# Altium project probe_v2.PrjPcb
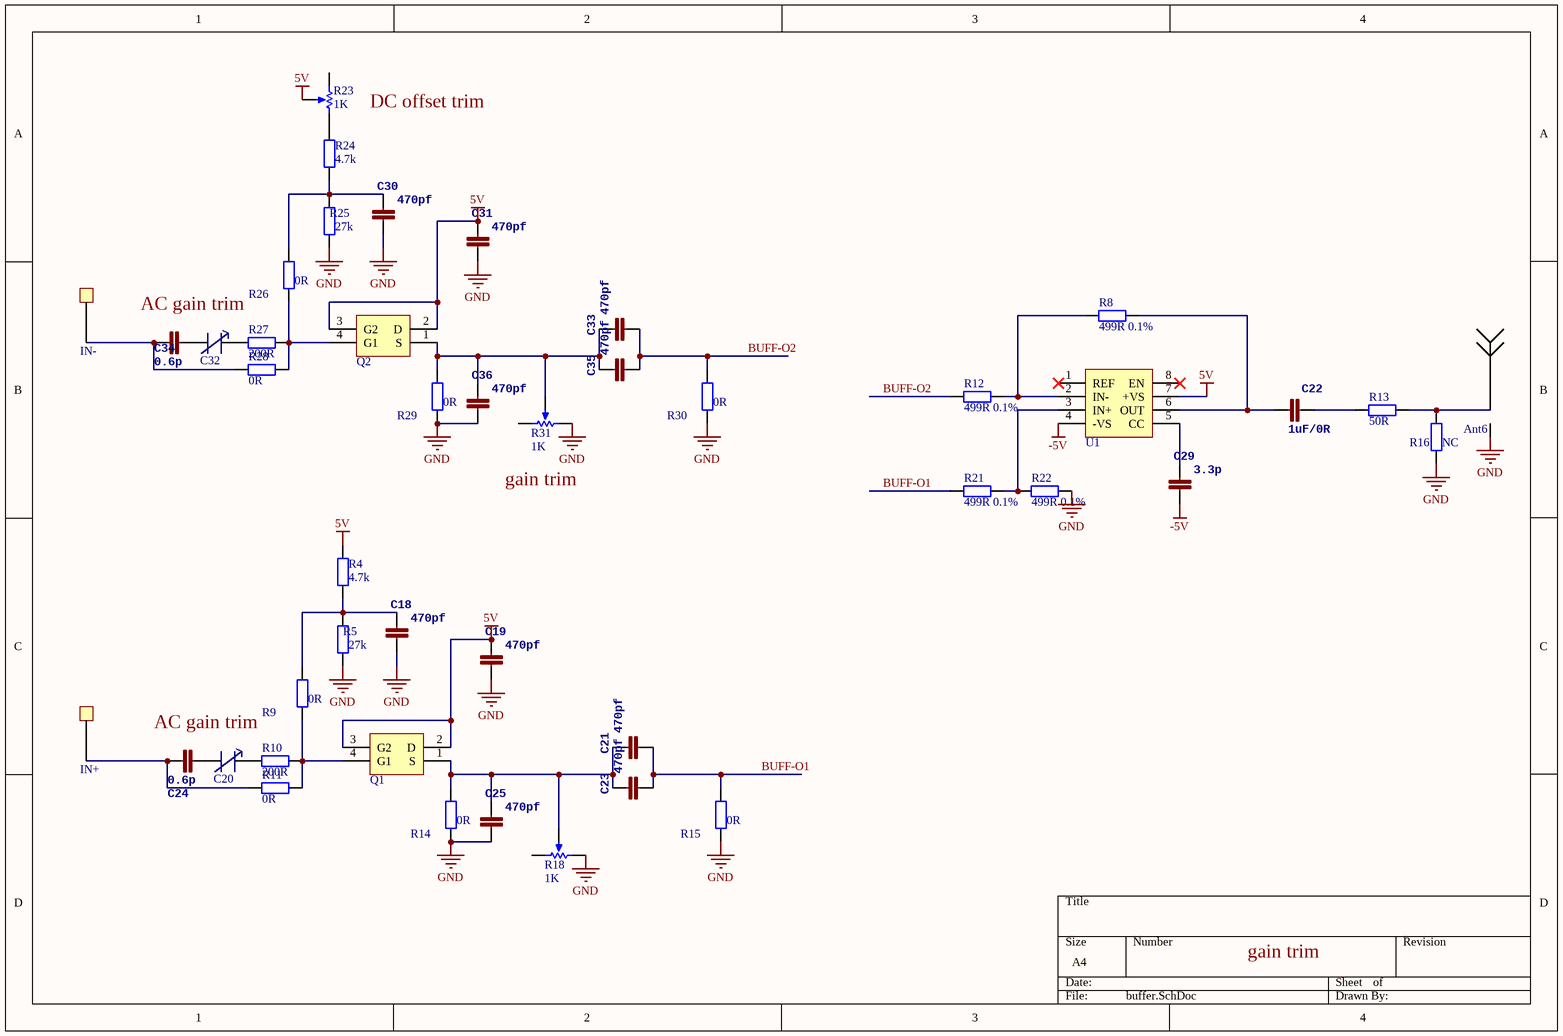
[diagram p0: buffer.SchDoc]
2 sheets, 78 parts. Net scope: global (net labels, ports and power ports of the same name join across sheets).
Board file: probe_v2.PcbDoc
Sheets:
  buffer.SchDoc
  power.SchDoc

## Sheet buffer.SchDoc
size A4

### Parts
Ant6  Antenna  [SMA-HOLE]  (value not drawn)
C18  470pf  [0402]
C19  470pf  [0805]
C20  TZY2R200AC01R00  [TRIM_C]  (value not drawn)
C21  470pf  [0402]
C22  1uF/0R  [0402]
C23  470pf  [0402]
C24  0.6p  [0402]
C25  470pf  [0402]
C29  3.3p  [0402]
C30  470pf  [0402]
C31  470pf  [0805]
C32  TZY2R200AC01R00  [TRIM_C]  (value not drawn)
C33  470pf  [0402]
C34  0.6p  [0402]
C35  470pf  [0402]
C36  470pf  [0402]
IN+  TestPad  [TestPad]  (value not drawn)
IN-  TestPad  [TestPad]  (value not drawn)
Q1  BF998  [SOT143]  (value not drawn)
Q2  BF998  [SOT143]  (value not drawn)
R4  4.7k  [0402]
R5  27k  [0402]
R8  499R 0.1%  [0402]
R9  0R  [0402]
R10  200R  [0402]
R11  0R  [0402]
R12  499R 0.1%  [0402]
R13  50R  [0402]
R14  0R  [0402]
R15  0R  [0402]
R16  NC  [0402]
R18  value 1K  [POT1]  (hidden comment: RPot)
R21  499R 0.1%  [0402]
R22  499R 0.1%  [0402]
R23  value 1K  [POT1]  (hidden comment: RPot)
R24  4.7k  [0402]
R25  27k  [0402]
R26  0R  [0402]
R27  200R  [0402]
R28  0R  [0402]
R29  0R  [0402]
R30  0R  [0402]
R31  value 1K  [POT1]  (hidden comment: RPot)
U1  AD8021  [SO8]  (value not drawn)

### Nets
5V: C19.2 C31.2 Q1.2(D) Q1.3(G2) Q2.2(D) Q2.3(G2) R4.2 R23.3(TAP) U1.7(+VS)
-5V: C29.1 U1.4(-VS)
GND: Ant6.GND(G) C18.1 C19.1 C25.1 C30.1 C31.1 C36.1 R5.2 R14.2 R15.2 R16.2 R18.1(TOP) R22.1 R25.2 R29.2 R30.2 R31.1(TOP)
BUFF-O1: C21.1 C23.1 R15.1 R21.1
BUFF-O2: C33.1 C35.1 R12.1 R30.1
NetAnt6_1: Ant6.1 R13.2 R16.1
NetC18_2: C18.2 R4.1 R5.1 R9.1
NetC20_1: C20.1 C24.1
NetC20_2: C20.2 R10.1
NetC21_2: C21.2 C23.2 C25.2 Q1.1(S) R14.1 R18.3(TAP)
NetC22_1: C22.1 R13.1
NetC22_2: C22.2 R8.2 U1.6(OUT)
NetC24_2: C24.2 IN+.1 R11.1
NetC29_2: C29.2 U1.5(CC)
NetC30_2: C30.2 R24.1 R25.1 R26.1
NetC32_1: C32.1 C34.1
NetC32_2: C32.2 R27.1
NetC33_2: C33.2 C35.2 C36.2 Q2.1(S) R29.1 R31.3(TAP)
NetC34_2: C34.2 IN-.1 R28.1
NetQ1_4: Q1.4(G1) R9.2 R10.2 R11.2
NetQ2_4: Q2.4(G1) R26.2 R27.2 R28.2
NetR8_1: R8.1 R12.2 U1.2(IN-)
NetR21_2: R21.2 R22.2 U1.3(IN+)
NetR23_2: R23.2(BOT) R24.2

Not connected (* = marked no-connect by the designer): R18 2(BOT); R23 1(TOP); R31 2(BOT); U1 1(REF)* 8(EN)*

### Notes on the sheet
- DC offset trim
- AC gain trim
- gain trim

### Library data of the parts
C18 C19 C21-C25 C29-C31 C33-C36 = CAP0402-CAP: <b>Capacitor</b> / Standard 0603 ceramic capacitor, and 0.1" leaded capacitor.; PARTNO: CC0402ZRY5V7BB104
C20 C32 = TRIM_C
R4 R5 R8-R16 R21 R22 R24-R30 = Res2: Resistor; Published: 8-Jun-2000; LatestRevisionDate: 17-Jul-2002; LatestRevisionNote: Re-released for DXP Platform.; PackageReference: AXIAL-0.4; Publisher: Altium Limited; PackageDescription: Axial Device, Thru-Hole; 2 Leads; 0.4 in Pin Spacing
R18 R23 R31 = RPot: Potentiometer; Sim Note: Enter the Resistance value and the set point into parameter fields.; Set Position: 0.5; Published: 8-Jun-2000; LatestRevisionDate: 17-Jul-2002; LatestRevisionNote: Re-released for DXP Platform.; PackageReference: VR5; Publisher: Altium Limited; PackageDescription: Variable Resistor, Thru-Hole; 3 Leads

## Sheet power.SchDoc
size A4
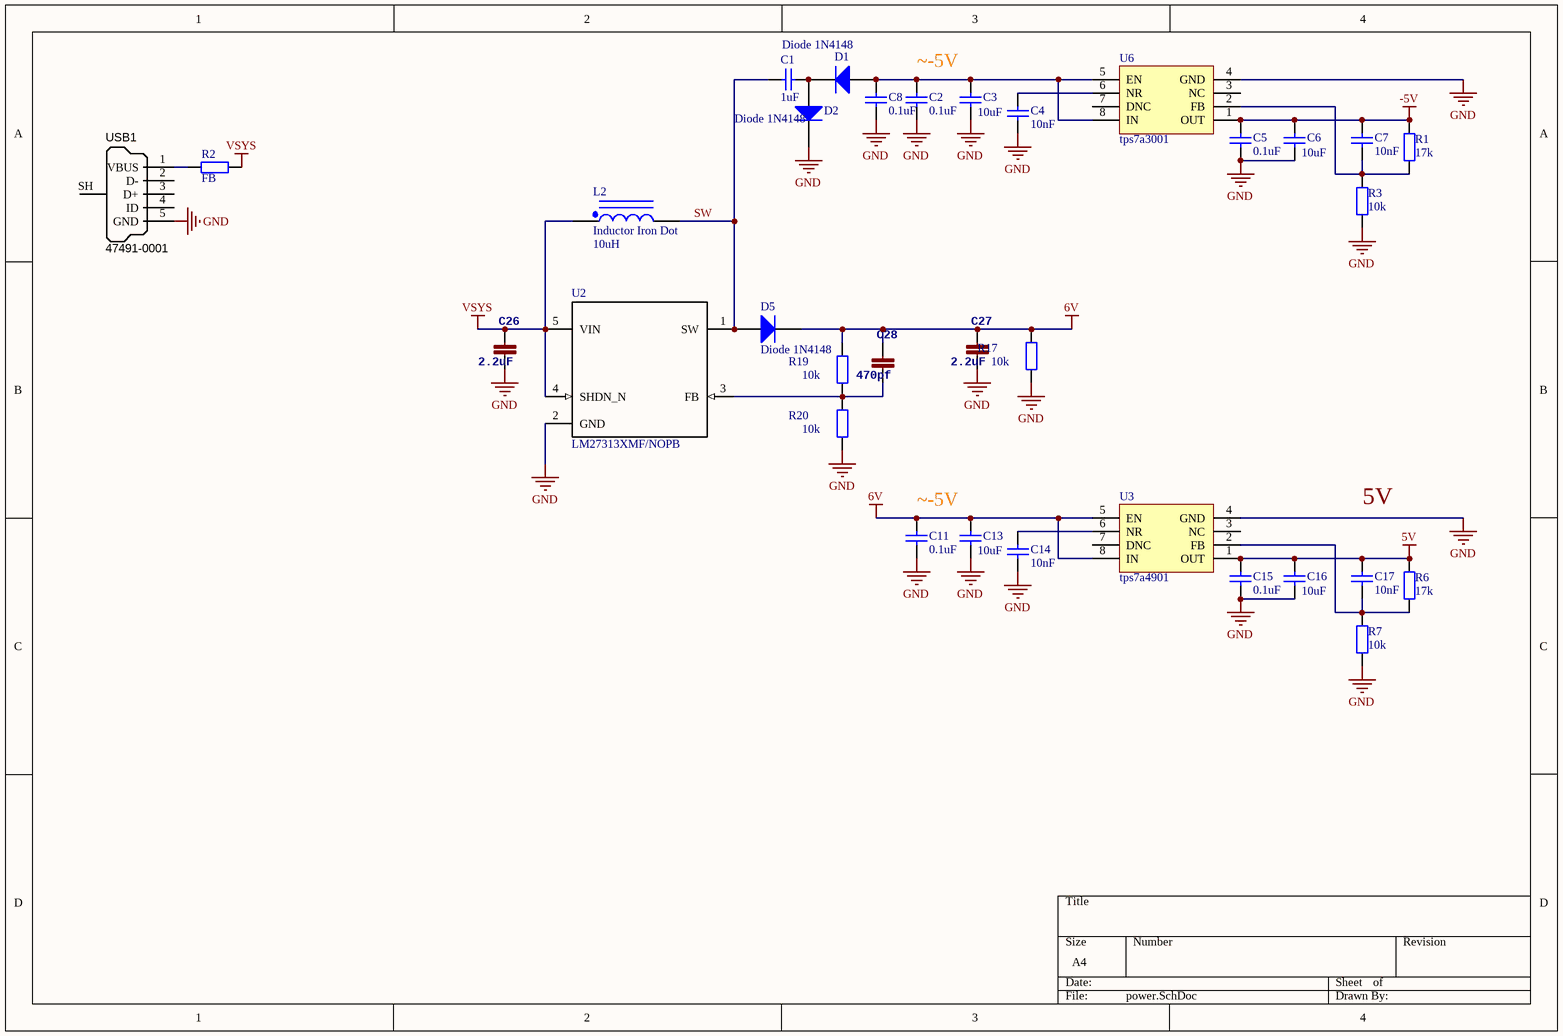
[diagram p1: power.SchDoc]

### Parts
C1  1uF  [0603]
C2  0.1uF  [0603]
C3  10uF  [0805]
C4  10nF  [0402]
C5  0.1uF  [0603]
C6  10uF  [0805]
C7  10nF  [0402]
C8  0.1uF  [0603]
C11  0.1uF  [0603]
C13  10uF  [0805]
C14  10nF  [0402]
C15  0.1uF  [0603]
C16  10uF  [0805]
C17  10nF  [0402]
C26  2.2uF  [0805]
C27  2.2uF  [0805]
C28  470pf  [0402]
D1  Diode 1N4148  [LC-SOD-323]
D2  Diode 1N4148  [LC-SOD-323]
D5  Diode 1N4148  [LC-SOD-323]
L2  Inductor Iron Dot  value 10uH  [L4015]
R1  17k  [0402]
R2  FB  [0603]
R3  10k  [0402]
R6  17k  [0402]
R7  10k  [0402]
R17  value 10k  [0402]
R19  value 10k  [0402]
R20  value 10k  [0402]
U2  LM27313XMF/NOPB  [SOT23-5]
U3  tps7a4901  [MSOP8/VSSOP8]
U6  tps7a3001  [MSOP8/VSSOP8]
USB1  Manufacturer Part Number 1: 47491-0001  [MICRO-YZX]  (hidden comment: USB Micro Type B)

### Nets
5V: C15.1 C16.2 C17.1 R6.2 U3.1(OUT)
6V: C11.1 C13.2 C27.2 C28.2 D5.2(K) R17.2 R19.2 U3.5(EN) U3.8(IN)
-5V: C5.1 C6.2 C7.1 R1.2 U6.1(OUT)
GND: C2.2 C3.1 C4.2 C5.2 C6.1 C8.2 C11.2 C13.1 C14.2 C15.2 C16.1 C26.1 C27.1 D2.2(K) R3.1 R7.1 R17.1 R20.1 U2.2(GND) U3.4(GND) U6.4(GND) USB1.5(GND)
VSYS: C26.2 L2.1 R2.2 U2.4(SHDN_N) U2.5(VIN)
SW: C1.2 D5.1(A) L2.2 U2.1(SW)
NetC1_1: C1.1 D1.2(K) D2.1(A)
NetC2_1: C2.1 C3.2 C8.1 D1.1(A) U6.5(EN) U6.8(IN)
NetC4_1: C4.1 U6.6(NR)
NetC7_2: C7.2 R1.1 R3.2 U6.2(FB)
NetC14_1: C14.1 U3.6(NR)
NetC17_2: C17.2 R6.1 R7.2 U3.2(FB)
NetC28_1: C28.1 R19.1 R20.2 U2.3(FB)
NetR2_1: R2.1 USB1.1(VBUS)

Not connected (* = marked no-connect by the designer): U3 3(NC) 7(DNC); U6 3(NC) 7(DNC); USB1 2(D-) 3(D+) 4(ID) SH(Shell)

### Notes on the sheet
- ~-5V
- 5V

### Library data of the parts
C1-C8 C11 C13-C17 = Cap: Capacitor; Published: 8-Jun-2000; LatestRevisionDate: 17-Jul-2002; LatestRevisionNote: Re-released for DXP Platform.; PackageReference: RAD-0.3; Publisher: Altium Limited; PackageDescription: Radial Cap, Thru-Hole; 2 Leads; 0.3 in Pin Spacing
C26-C28 = CAP0402-CAP: as C18 on sheet buffer
D1 D2 D5 = Diode 1N4148: High Conductance Fast Diode; Published: 8-Jun-2000; LatestRevisionDate: 17-Jul-2002; LatestRevisionNote: Re-released for DXP Platform.; DatasheetVersion: 1997; PackageReference: DO-35; Publisher: Altium Limited; PackageDescription: Diode, Axial; Body 3.8 x 1.9 mm (LxDia. max), Lead Dia. 0.53 mm (max); Code_JEDEC: DO-204-AH; ComponentLink1Description: Manufacturer Link; ComponentLink1URL: http://www.fairchildsemi.com/; ComponentLink2Description: Datasheet; ComponentLink2URL: http://www.fairchildsemi.com/ds/1N%2F1N4148.pdf
L2 = Inductor Iron Dot: Magnetic-Core Inductor with Winding Polarity Marking; Published: 24-Mar-1999; LatestRevisionDate: 17-Jul-2002; LatestRevisionNote: Re-released for DXP Platform.; PackageReference: DIODE_SMC; Publisher: Altium Limited; PackageDescription: Diode; 2 Leads
R1-R3 R6 R7 R17 R19 R20 = Res2: Resistor; Published: 8-Jun-2000; LatestRevisionDate: 17-Jul-2002; LatestRevisionNote: Re-released for DXP Platform.; PackageReference: AXIAL-0.4; Publisher: Altium Limited; PackageDescription: Axial Device, Thru-Hole; 2 Leads; 0.4 in Pin Spacing
U2 = LM27313XMF/NOPB: Imported; Manufacturer: Texas Instruments; CompType: IC; PIN_COUNT: 5; PartNumber: LM27313XMF/NOPB; PackageReference: DBV0005A; MountType: SMT; RoHS: Y; RefDes: RefDes; Type: DEV; Value: Value
U3 = tps7a3001
USB1 = USB_Micro_TypeB: Connector SMD USB Micro Type B middle mount; Manufacturer 1: Molex Inc; SCDType: undef; Package / Case: SMD; Supplier 1: Digi-Key; Supplier Part Number 1: WM17142CT-ND

## Nets that join several sheets
5V: buffer (9 pins), power (5 pins)
-5V: buffer (C29.1 U1.4), power (5 pins)
GND: buffer (17 pins), power (22 pins)